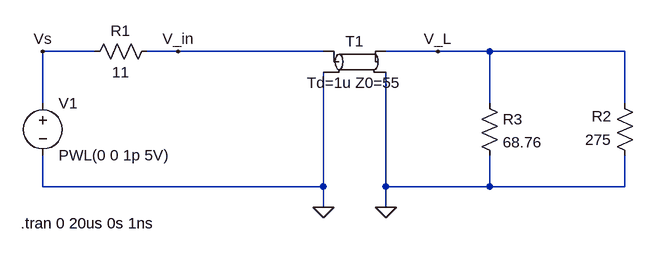
[diagram p0: schematic hw2_p2f_eantunano.asc]
hw2_p2f_eantunano.asc, the LTspice schematic file:
Version 4
SHEET 1 880 680
WIRE -16 48 -96 48
WIRE 112 48 64 48
WIRE 336 48 112 48
WIRE 512 48 432 48
WIRE 592 48 512 48
WIRE 800 48 592 48
WIRE -96 128 -96 48
WIRE 592 128 592 48
WIRE 800 128 800 48
WIRE -96 256 -96 208
WIRE 336 256 336 80
WIRE 336 256 -96 256
WIRE 432 256 432 80
WIRE 592 256 592 208
WIRE 592 256 432 256
WIRE 800 256 800 208
WIRE 800 256 592 256
WIRE 336 288 336 256
WIRE 432 288 432 256
FLAG 432 288 0
FLAG 336 288 0
FLAG 512 48 V_L
FLAG 112 48 V_in
FLAG -96 48 Vs
SYMBOL voltage -96 112 R0
WINDOW 123 0 0 Left 0
WINDOW 39 0 0 Left 0
SYMATTR InstName V1
SYMATTR Value PWL(0 0 1p 5V)
SYMBOL res 80 32 R90
WINDOW 0 0 56 VBottom 2
WINDOW 3 32 56 VTop 2
SYMATTR InstName R1
SYMATTR Value 11
SYMBOL res 816 224 R180
WINDOW 0 36 76 Left 2
WINDOW 3 36 40 Left 2
SYMATTR InstName R2
SYMATTR Value 275
SYMBOL tline 384 64 R0
SYMATTR InstName T1
SYMATTR Value Td=1u Z0=55
SYMBOL res 576 112 R0
SYMATTR InstName R3
SYMATTR Value 68.76
TEXT -130 312 Left 2 !.tran 0 20us 0s 1ns

The netlist it stands for:
* hw2_p2f_eantunano.asc
V1 Vs 0 PWL(0 0 1p 5V)
R1 V_in Vs 11
R2 0 V_L 275
T1 V_in 0 V_L 0 Td=1u Z0=55
R3 V_L 0 68.76
.tran 0 20us 0s 1ns
.backanno
.end

* Results of the author's LTspice run, read from the files saved beside the schematic
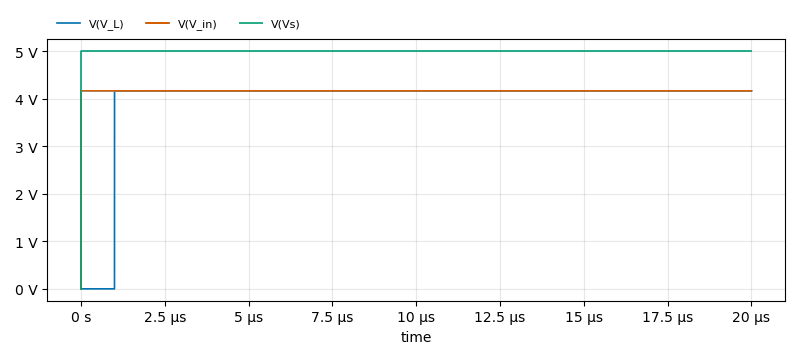
[diagram p1: Transient Analysis of hw2_p2f_eantunano.asc, plotted from the saved traces]
* Transient Analysis, 1 run:
*   V(V_L): min 0 V, max 4.167 V, average 3.958 V, rms 4.061 V, last 4.167 V
*   V(V_in): min 0 V, max 4.167 V, average 4.167 V, rms 4.167 V, last 4.167 V
*   V(Vs): min 0 V, max 5 V, average 5 V, rms 5 V, last 5 V